# Altium schematic sheet MCU.SchDoc
size B; SheetNumber: 1; SheetTotal: 4
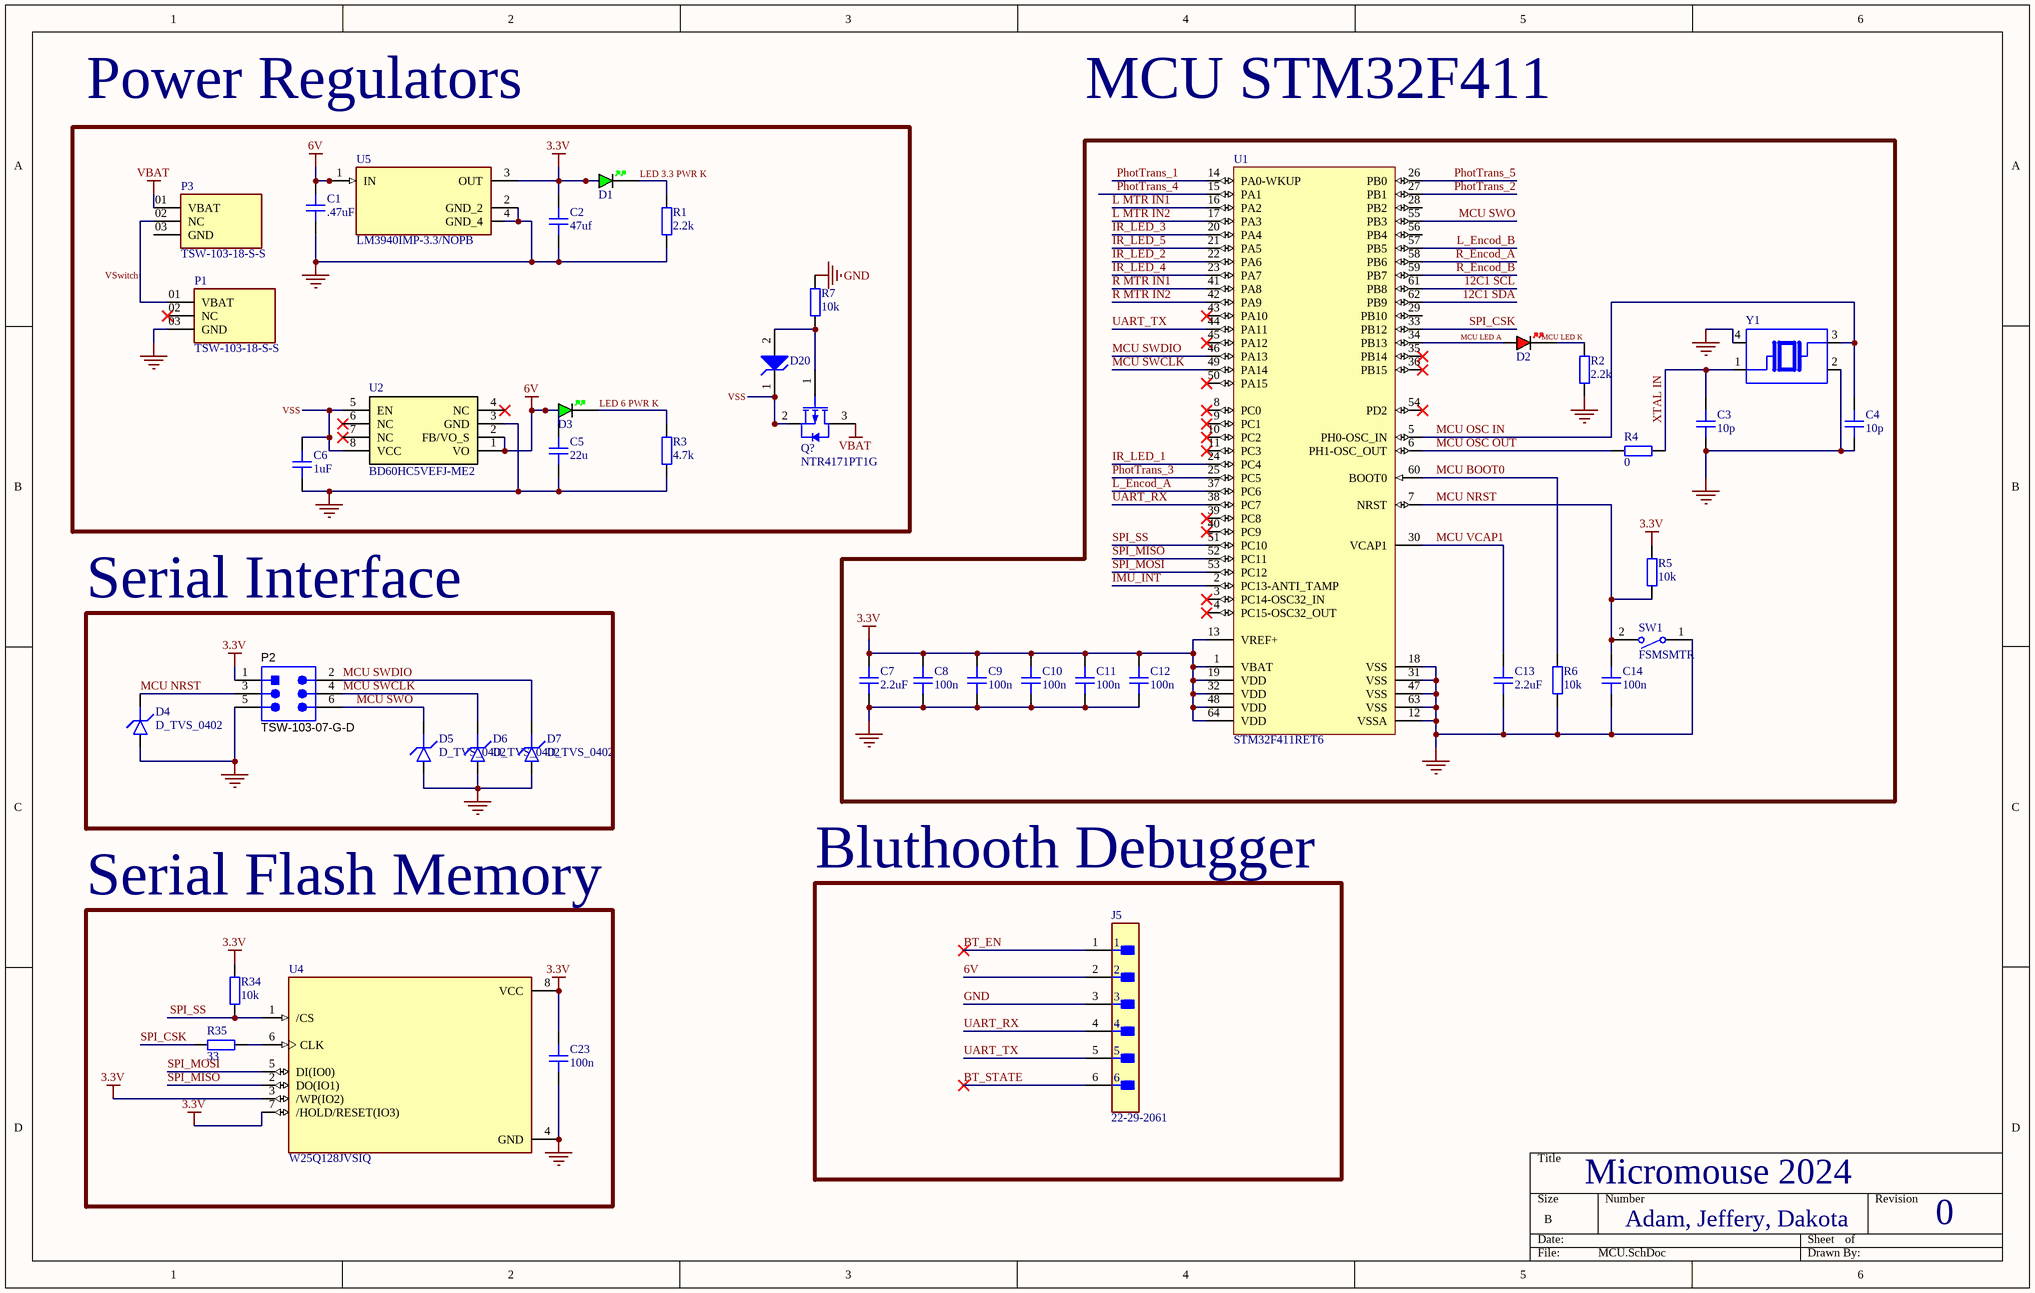
[diagram p0: MCU.SchDoc]

## Parts
C1  .47uF  [CAP_0603]
C2  47uf  [CAP_1210]
C3  10p  [CAP_0603]
C4  10p  [CAP_0603]
C5  22u  [CAP_0805]
C6  1uF  [CAP_0603]
C7  2.2uF  [CAP_0603]
C8  100n  [CAP_0603]
C9  100n  [CAP_0603]
C10  100n  [CAP_0603]
C11  100n  [CAP_0603]
C12  100n  [CAP_0603]
C13  2.2uF  [CAP_0603]
C14  100n  [CAP_0603]
C23  100n  [CAP_0603]
D1  GREEN  [LED_0603_GREEN]  (value not drawn)
D2  RED  [LED_0603_RED]  (value not drawn)
D3  GREEN  [LED_0603_GREEN]  (value not drawn)
D4  D_TVS_0402  [D_0402]
D5  D_TVS_0402  [D_0402]
D6  D_TVS_0402  [D_0402]
D7  D_TVS_0402  [D_0402]
D20  MMSZ4697T1G  [ONSC-SOD-123-2-425-04_V]  (value not drawn)
J5  22-29-2061  [FP-22-29-2061-MFG]
P1  TSW-103-18-S-S  [SAMTEC_TSW-103-18-S-S]
P2  TSW-103-07-G-D  [SMTC-TSW-103-07-G-D_V]
P3  TSW-103-18-S-S  [SAMTEC_TSW-103-18-S-S]
Q?  NTR4171PT1G  [ONSC-SOT-23-3-318-08_V]
R1  2.2k  [RES_0603]
R2  2.2k  [RES_0603]
R3  4.7k  [RES_0603]
R4  0  [RES_0603]
R5  10k  [RES_0603]
R6  10k  [RES_0603]
R7  10k  [RES_0603]
R34  10k  [RES_0603]
R35  33  [RES_0603]
SW1  FSMSMTR  [TECO-FSMSMTR_V]
U1  STM32F411RET6  [STM-LQFP64_L]
U2  BD60HC5VEFJ-ME2  [TSOP127P600X100_HS-9N]
U4  W25Q128JVSIQ  [SOIC127P790X216-8N]
U5  LM3940IMP-3.3/NOPB  [VREG_LM3940IMP-3.3/NOPB]
Y1  TSX-322524.0000MF15X-AC3  [OSCCC320X250X60]  (value not drawn)

## Blocks framed on the sheet
Power Regulators: C1 C2 C5 C6 D1 D3 D20 P1 P3 Q? R1 R3 R7 U2 U5
Serial Interface: D4-D7 P2
Bluthooth Debugger: J5
Serial Flash Memory: C23 R34 R35 U4

## Nets
3.3V: C2.2 C7.2 C8.2 C9.2 C10.2 C11.2 C12.2 C23.2 D1.A P2.1 R5.2 R34.1 U1.1(VBAT) U1.13(VREF+) U1.19(VDD) U1.32(VDD) U1.48(VDD) U1.64(VDD) U4.3(/WP(IO2)) U4.7(/HOLD/RESET(IO3)) U4.8(VCC) U5.3(OUT)
6V: C1.2 C5.2 D3.A J5.2 U2.1(VO) U2.2(FB/VO_S) U5.1(IN)
GND: C1.1 C2.1 C3.1 C4.1 C5.1 C6.1 C7.1 C8.1 C9.1 C10.1 C11.1 C12.1 C13.1 C14.1 C23.1 D4.A D5.A D6.A D7.A J5.3 P1.03(GND) P2.5 R1.1 R2.1 R3.1 R6.1 R7.2 SW1.1 U1.12(VSSA) U1.18(VSS) U1.31(VSS) U1.47(VSS) U1.63(VSS) U2.3(GND) U4.4(GND) U5.2(GND_2) U5.4(GND_4) Y1.2 Y1.4
VBAT: P3.01(VBAT) Q?.3(D)
12C1 SCL: U1.61(PB8)
12C1 SDA: U1.62(PB9)
BT_EN: J5.1
BT_STATE: J5.6
IMU_INT: U1.2(PC13-ANTI_TAMP)
IR_LED_1: U1.24(PC4)
IR_LED_2: U1.22(PA6)
IR_LED_3: U1.20(PA4)
IR_LED_4: U1.23(PA7)
IR_LED_5: U1.21(PA5)
L MTR IN1: U1.16(PA2)
L MTR IN2: U1.17(PA3)
L_Encod_A: U1.37(PC6)
L_Encod_B: U1.57(PB5)
LED 3.3 PWR K: D1.K R1.2
LED 6 PWR K: D3.K R3.2
MCU BOOT0: R6.2 U1.60(BOOT0)
MCU LED A: D2.A U1.34(PB13)
MCU LED K: D2.K R2.2
MCU NRST: C14.2 D4.K P2.3 R5.1 SW1.2 U1.7(NRST)
MCU OSC IN: C4.2 U1.5(PH0-OSC_IN) Y1.3
MCU OSC OUT: R4.1 U1.6(PH1-OSC_OUT)
MCU SWCLK: D6.K P2.4 U1.49(PA14)
MCU SWDIO: D7.K P2.2 U1.46(PA13)
MCU SWO: D5.K P2.6 U1.55(PB3)
MCU VCAP1: C13.2 U1.30(VCAP1)
PhotTrans_1: U1.14(PA0-WKUP)
PhotTrans_2: U1.27(PB1)
PhotTrans_3: U1.25(PC5)
PhotTrans_4: U1.15(PA1)
PhotTrans_5: U1.26(PB0)
R MTR IN1: U1.41(PA8)
R MTR IN2: U1.42(PA9)
R_Encod_A: U1.58(PB6)
R_Encod_B: U1.59(PB7)
SPI_CSK: R35.2 U1.33(PB12)
SPI_MISO: U1.52(PC11) U4.2(DO(IO1))
SPI_MOSI: U1.53(PC12) U4.5(DI(IO0))
SPI_SS: R34.2 U1.51(PC10) U4.1(/CS)
UART_RX: J5.4 U1.38(PC7)
UART_TX: J5.5 U1.44(PA11)
VSS: C6.2 D20.1(K) Q?.2(S) U2.5(EN) U2.8(VCC)
VSwitch: P1.01(VBAT) P3.02(NC)
XTAL IN: C3.2 R4.2 Y1.1
NetD20_2: D20.2(A) Q?.1(G) R7.1
NetR35_1: R35.1 U4.6(CLK)

Not connected (* = marked no-connect by the designer): P1 02(NC)*; P3 03(GND); U1 3(PC14-OSC32_IN)* 4(PC15-OSC32_OUT)* 8(PC0)* 9(PC1)* 10(PC2)* 11(PC3)* 28(PB2) 29(PB10) 35(PB14)* 36(PB15)* 39(PC8)* 40(PC9)* 43(PA10)* 45(PA12)* 50(PA15)* 54(PD2)* 56(PB4); U2 4(NC)* 6(NC)* 7(NC)*

## Notes on the sheet
- MCU STM32F411
- Micromouse 2024
- Adam, Jeffery, Dakota
- 0

## Library data of the parts
C1 C3 C4 C6-C14 C23 = CAP_0603: Capacitor SMD 0603; Manufacturer: *; Manufacturer Part Number: *; Distributor Link: *; LCSC: *; Rating: *; Dielectric: *
C2 = CAP_1210: Capacitor SMD 1210; Manufacturer: *; Manufacturer Part Number: *; Distributor Link: *; LCSC: *; Rating: *; Dielectric: *
C5 = CAP_0805: Capacitor SMD 0805; Manufacturer: *; Manufacturer Part Number: *; Distributor Link: *; LCSC: *; Rating: *; Dielectric: *
D1 D3 = LED_0603_GREEN: LED 0603 GREEN SMD
D2 = LED_0603_RED: LED 0603 RED SMD
D4-D7 = D_TVS_0402: Diode TVS / ESD 0402
D20 = CMP-1060-00438-1: Zener Voltage Regulator, 500 mW, 2-Pin SOD-123, Pb-Free, Tape and Reel; Manufacturer: On Semiconductor; VZ Typ (V): 10; P Max (W): 0.5; ComponentLink3Description: Package Specification; ComponentLink3URL: http://www.onsemi.com/pub_link/Collateral/425-04.PDF; ComponentLink2Description: Datasheet; Packing: Tape and Reel; RoHS: Pb-Free; DatasheetVersion: Rev. 9; PackageVersion: Rev. G, 10/2009; ComponentLink2URL: http://www.onsemi.com/pub_link/Collateral/MMSZ4678T1-D.PDF; ComponentLink1URL: http://www.onsemi.com/; PackageReference: SOD-123-2-425-04; PackageDescription: 2-Pin SOD, Body 1.6 x 2.69 mm; PartNumber: MMSZ4697T1G; Mounting Technology: Surface Mount; ComponentLink1Description: Manufacturer URL
J5 = CMP-04776-000348-1: CONN HEADER VERT 6POS 2.54MM; Gender: Male; Number of Poles: 6; Voltage Rating: 250V; Insulation Resistance: 50GR; Contact Resistance: 10mR; Current Rating: 4A; Number of Lines: 1; Height: 11.7mm; Mount: Through Hole; Length: 15.24mm; Contact Plating: Gold; Contact Type: Male Pin; Contact Material: Brass; Housing Material: Nylon; Series: KK® 6410; Number of Positions: 6; Contact Mating Length: 0.295inch; Fastening Type: Friction; RoHS Compliant: Yes; Color: Natural; Max Operating Temperature: 75°C; Contact Gender: Male; Packaging: Bulk; Termination: Solder; Voltage Rating (DC): 250V; Orientation: Straight; Radiation Hardening: No; Flammability Rating: UL94 V-0; Package Quantity: 1000; Housing Color: White; Number of Rows: 1; Min Operating Temperature: 0°C; Max Current Rating: 4A; Pitch: 2.54mm; Depth: 5.8mm; Number of Contacts: 6; Lead Free: Lead Free
P2 = CMP-2000-07329-1: Through Hole Header, Pitch 2.54 mm, 2 x 3 Position, Height 8.58 mm, Tail Length 2.54 mm, -55 to 125 degC, RoHS, Bulk; Manufacturer: Samtec-Inc.; Number of Positions Loaded: All; Number of Positions: 6; Row Spacing: 0.100"(2.54mm); Connector Type: Header,Unshrouded; Package Reference: TSW-103-07-G-D; Termination: Solder; Manufacturer URL: http://www.samtec.com/; Contact Finish: Gold; Contact Mating Length: 0.230"(5.84mm); Package Description: Through Hole Header, Pitch 2.54 mm, 2 x 3 Position, Height 8.58 mm, Tail Length 2.54 mm; Datasheet Version: 12/2015; Number of Rows: 2; Features: -; Family: RectangularConnectors-Headers,MalePins; Fastening Type: -; Datasheet URL: http://suddendocs.samtec.com/catalog_english/tsw_th.pdf; Category: Connectors,Interconnects; Package URL: http://suddendocs.samtec.com/prints/tsw-xxx-xx-xxx-x-xx-xxx-mkt.pdf; Mounting Type: ThroughHole; Contact Finish Thickness: 10µin(0.25µm); Packaging: Bulk; Color: Black; Pitch: 0.100"(2.54mm); Series: TSW; Contact Type: MalePin; Mounting Technology: ThroughHole
Q? = CMP-1058-00738-1: Power MOSFET, -30 V, 3.5 A, Single P-Channel, 3-Pin SOT-23, Pb-Free, Tape and Reel; Manufacturer: On Semiconductor; VGS Max (V): 12; V(BR)DSS Min (V): 30; Crss Typ (pF): 65; VGS(th) Max (V): 1.4; Ciss Typ (pF): 720; Qrr Typ (nC): 8; Coss Typ (pF): 95; Channel Polarity: P Channel; ComponentLink2URL: http://www.onsemi.cn/pub_link/Collateral/NTR4171P-D.PDF; ComponentLink1Description: Manufacturer URL; PartNumber: NTR4171PT1G; Mounting Technology: Surface Mount; ComponentLink1URL: http://www.onsemi.com/; Packing: Tape and Reel; Package Type: SOT-23-3; ComponentLink2Description: Datasheet; PackageReference: SOT-23-3-318-08; Configuration: Single; ComponentLink3Description: Package Specification; DatasheetVersion: Rev. 1; PackageVersion: Rev. AP, 11/2009; RoHS: Pb-Free; PackageDescription: 3-Pin Small Outline Transistor, Body 2.92 x 1.3 mm, Pitch 0.95 mm; ComponentLink3URL: http://www.onsemi.cn/pub_link/Collateral/318-08.PDF
R1-R7 R34 R35 = RES_0603: Resistor SMD 0603; Manufacturer: *; Manufacturer Part Number: *; Distributor Link: *; LCSC: *
SW1 = CMP-2000-07501-1: FSMSM Push Button Switch, 50 mA, -35 to 85 degC, 2-Pin SMD, RoHS, Tape and Reel; Manufacturer: TE Connectivity; Voltage Rating (DC): 24V; Electrical Life: 20000Cycles; Operating Force: 180gf; Switch Travel: 0.25mm; Contact Current Rating: 50mA; Case\/Package: SMD/SMT; Actuator Length: 1.07mm; Throw Configuration: SPST; Actuator Material: Polyamide; Contact Resistance: 100mOhm; Illumination Type: Illuminated; Max Voltage Rating (DC): 12V; Manufacturer URL: http://www.te.com/; Lead Free: LeadFree; Packaging: TapeandReel; Min Operating Temperature: -35degC; Mechanical Life: 20000Cycles; Mount: SurfaceMount; REACH SVHC: Unknown; Package Quantity: 1800; Package Reference: FSMSMTR; RoHSCompliant: true; Max Operating Temperature: 85degC; Orientation: Straight; ELV: Compliant; Datasheet URL: http://www.te.com/commerce/DocumentDelivery/DDEController?Action=showdoc&DocId=Customer+Drawing%7F1437566-3%7FC2%7Fpdf%7FEnglish%7FENG_CD_1437566-3_C2_1437566_3_1_c.dwg.pdf%7F1437566-4; Package Description: 2-Pin Surface Mount Device, Body 6 x 3.5 mm, Pitch 9.19 mm; Current Rating: 50mA; Contact Plating: Silver; Termination: GullWing; Datasheet Version: Rev. C2, 08/2014; Contact Material: Brass; Mounting Technology: SurfaceMount
U1 = CMP-0243-00169-1: ARM Cortex-M4 32-bit MCU+FPU, 512 KB Flash, 128 KB RAM, 50 I/Os, 64-Pin LQFP, -40 to 85 degC, Tray; Operating Frequency(F) (Processor speed) (MHz): 100; FLASH Size (Prog) (kB): 512; Supply Voltage(Vcc) min (V): 1.7; Internal RAM Size (kB): 128; I/Os (High Current): 50; Packing: Tray; ComponentLink1Description: Manufacturer URL; Package Description: LQFP64; DatasheetVersion: Rev. 6; Mounting Technology: Surface Mount; Package Reference: 64-Pin Low-profile Quad Flat Package, Body 10 x 10 mm, Pitch 0.5 mm; ComponentLink2Description: Datasheet; Core: ARM Cortex-M4; ComponentLink2URL: http://www.st.com/st-web-ui/static/active/en/resource/technical/document/datasheet/DM00115249.pdf; ComponentLink1URL: http://www.st.com/
U2 = BD60HC5VEFJ-ME2: Linear Voltage Regulator IC Positive Fixed 1 Output 1.5A 8-HTSOP-J; Manufacturer: Rohm; Supplier: Newark; Supplier Part Number: 78AK2890; Manufacturer Part Number: BD60HC5VEFJ-ME2; RoHS: No; Stock: 100; Pricing: 1=1.41, 10=1.25, 25=1.19, 50=1.08, 100=0.978, 250=0.914, 500=0.808, 1000=0.638 (USD)
U4 = CMP-031-00007-1: FLASH - NOR Memory IC 128Mb (16M x 8) SPI - Quad I/O, QPI, DTR 133 MHz 8-SOIC; MF: Winbond Electronics; SnapEDA_Link: https://www.snapeda.com/parts/W25Q128JVSIQ/Winbond+Electronics/view-part/?ref=snap; Pins: 8; Price: None; Purchase-URL: https://pricing.snapeda.com/search/part/W25Q128JVSIQ/?ref=eda; Source: W25Q128JVSIQ.SchLib; Case/Package: SOIC-8 Winbond; MP: W25Q128JVSIQ; Design Item ID: W25Q128JVSIQ; Value: *; Check_prices: https://www.snapeda.com/parts/W25Q128JVSIQ/Winbond+Electronics/view-part/?ref=eda; Availability: In Stock; Component Type: Standard
U5 = LM3940IMP-3.3/NOPB: Ð›Ð¸Ð½ÐµÐ¹Ð½Ñ‹Ð¹ ÑÑ‚Ð°Ð±Ð¸Ð»Ð¸Ð·Ð°Ñ‚Ð¾Ñ€ Ð½Ð°Ð¿Ñ€ÑÐ¶ÐµÐ½Ð¸Ñ IC 1 Output 1A SOT-223-4; MP: LM3940IMP33; MF: National Semiconductor; SnapEDA_Link: https://www.snapeda.com/parts/LM3940IMP33/Texas%20Instruments/view-part/21631/?ref=snap; Value: *; Availability: Unavailable; Package: SOT-223-4 National Semiconductor; Check_prices: https://www.snapeda.com/parts/LM3940IMP33/Texas%20Instruments/view-part/21631/?ref=eda; Price: None
Y1 = TSX-322524.0000MF15X-AC3: 24MHz Â±10ppm Crystal 9pF 40 Ohms 4-SMD, No Lead; MF: EPSON; Availability: Unavailable; Value: *; Package: SMD-4 EPSON; Price: None; SnapEDA_Link: https://www.snapeda.com/parts/TSX-3225%2024.0000MF15X-AC3/EPSON/view-part/230042/?ref=snap; MP: TSX-3225 24.0000MF15X-AC3